# Altium project Flight_Control_Board_Davut_Beyazkaya.PrjPcb
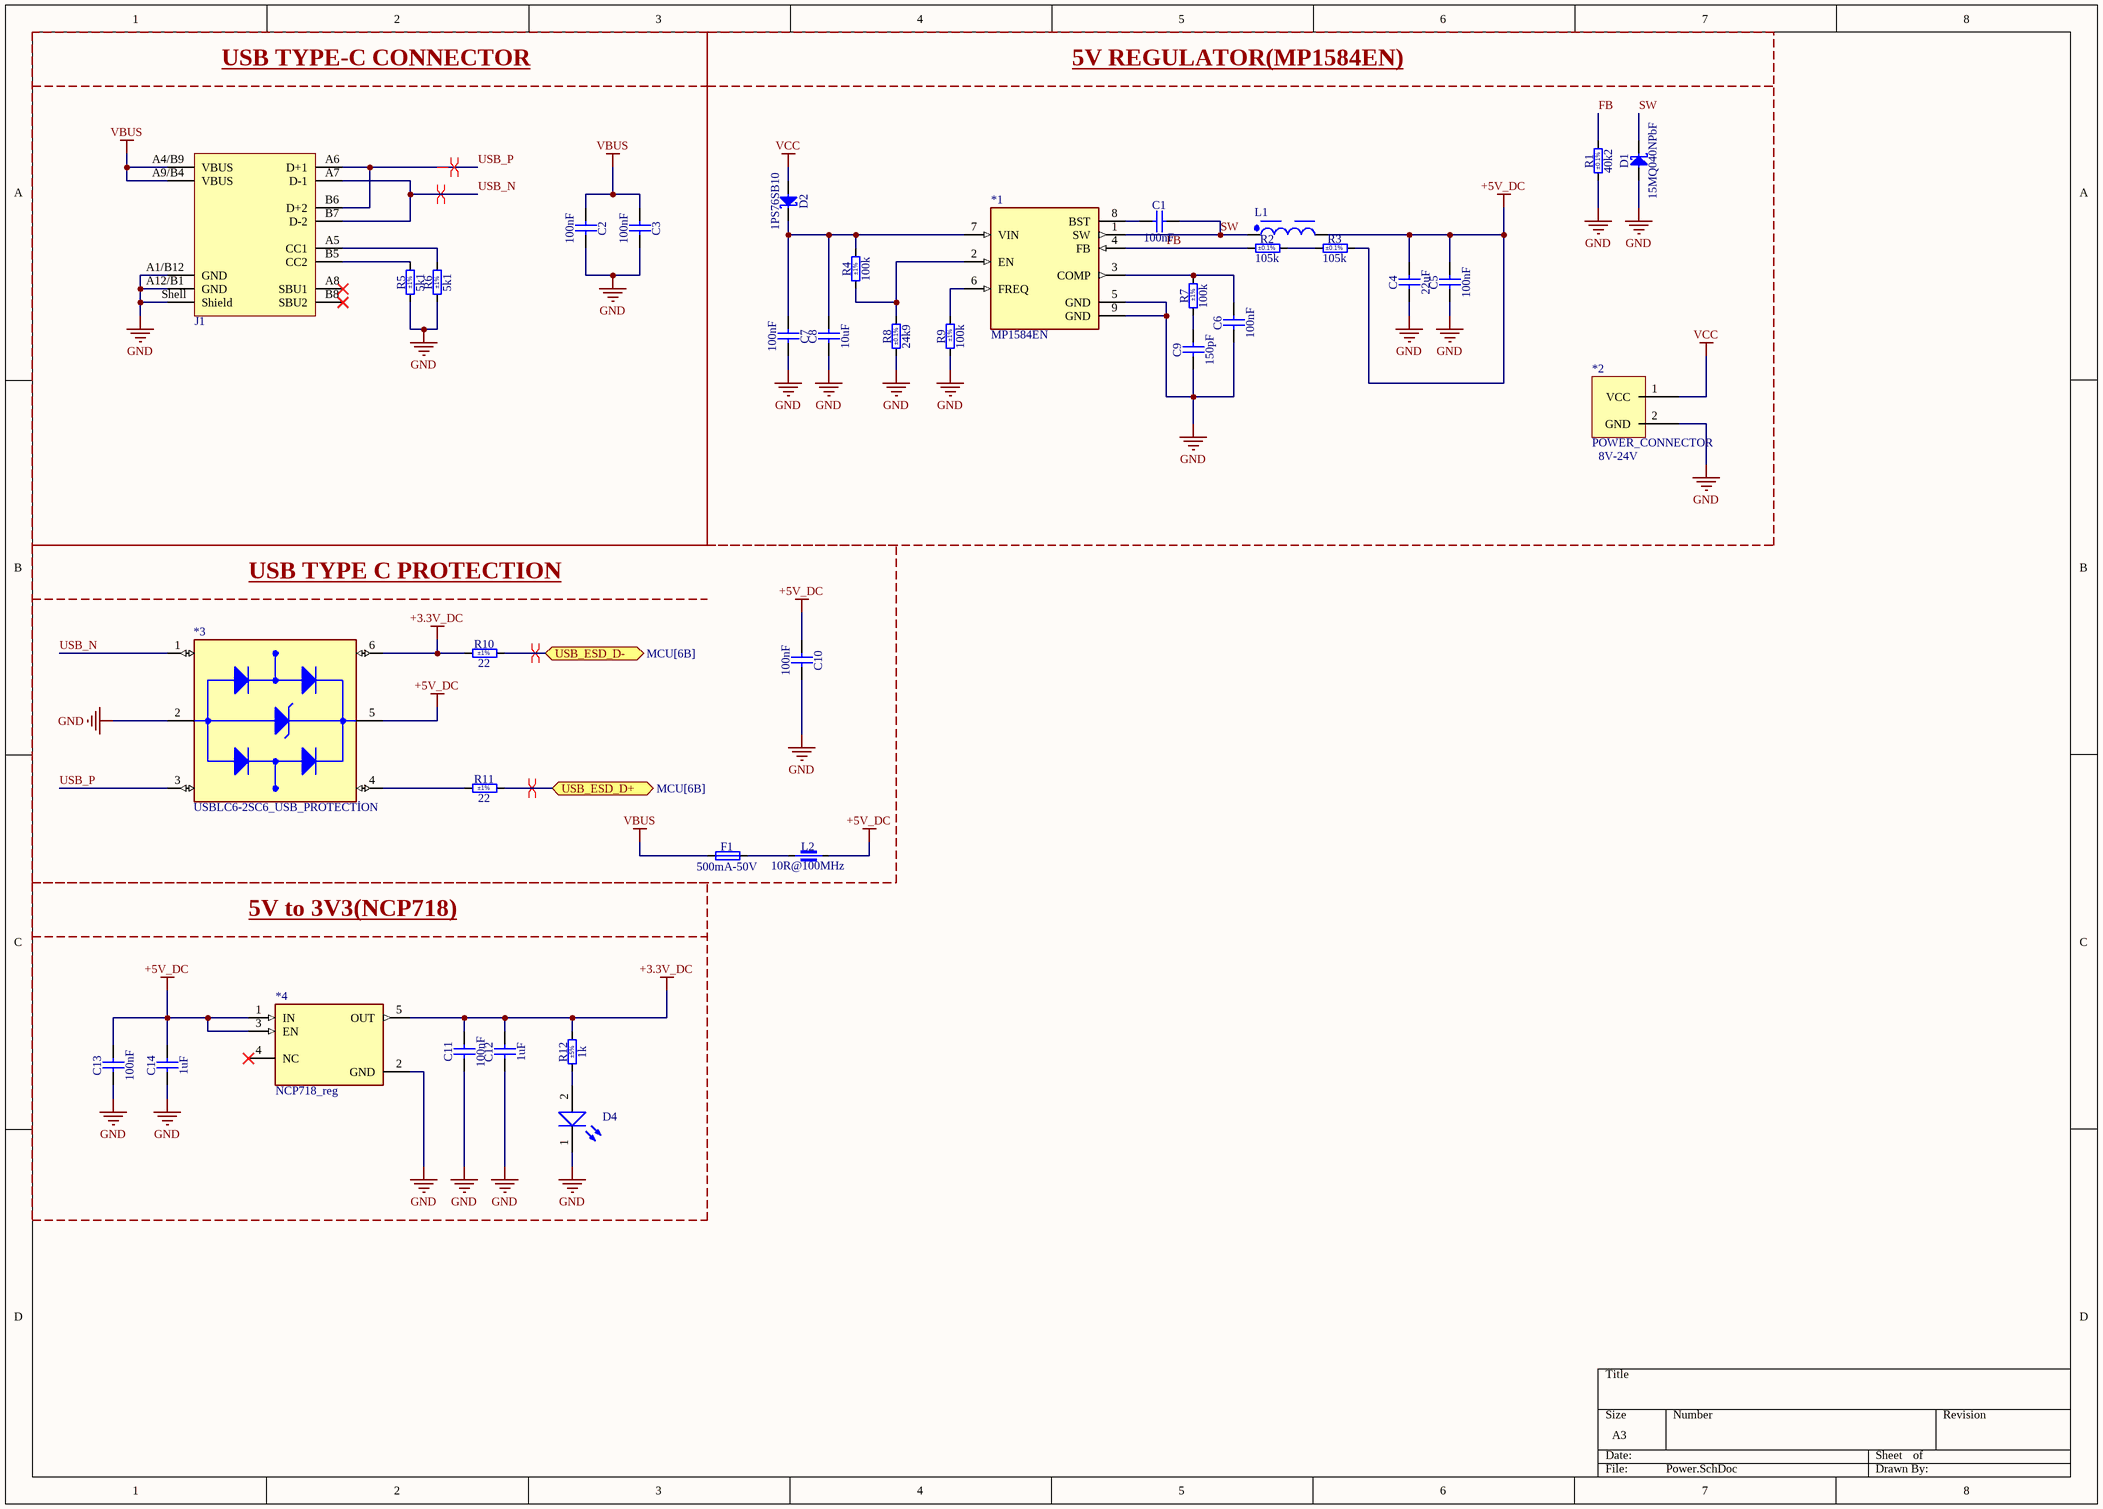
[diagram p0: Power.SchDoc]
3 sheets, 107 parts. Net scope: flat (ports and power ports of the same name join across sheets).
Board file: fligt_control_card.PcbDoc
Sheets:
  Power.SchDoc
  MCU.SchDoc
  Modules.SchDoc

## Sheet Power.SchDoc
size A3; DrawnBy: Davut Beyazkaya; SheetNumber: 1; SheetTotal: 3; SPICEModelCacheTCAMPDML: <root> / <DocumentId>TCAMPDML</DocumentId> / <CacheFrame Number="0"> / <Model Name="3014_158301227" Kind="CKT"> / <Text>************************************************** / * Manufacturer:           Wurth Elektronik / * Kinds:                  SMT White Top view PLCC / * Matchcode:              WL-SWTP / * Library Type:           LTspice / * Version:                rev22a / * Created/modified by:    Ella / * Date and Time:          2022-03-02 / * Team:                   eiSos EDA Service / * Contact:                libraries@we-online.com / ************************************************** / * Copyright(C) 2022 WÃ¼rth Elektronik eiSos GmbH &amp; Co. KG / * All Rights Reserved. / ************************************************** / * Disclaimer: While WÃ¼rth Elektronik eiSos has made every reasonable effort to ensure the accuracy / * of the simulation models provided, WÃ¼rth Elektronik eiSos does not guarantee the exemption of error on / * the simulation models, nor does WÃ¼rth Elektronik eiSos guarantee that the simulation model is current. / * WÃ¼rth Elektronik eiSos reserves the right to make any adjustments at any time without notice. / * WÃ¼rth Elektronik eiSos expressly disclaims all implied warranties regarding this simulation model. / ************************************************** / .subckt 3014_158301227  1  2 / D1 1 2 led / .MODEL led D / + IS=91.819E-12 / + N=4.0378 / + RS=11.199E-6 / + IKF=1.1025E-6 / + CJO=1.0000E-12 / + M=.3333 / + VJ=.75 / + BV=5 / + IBV=5.00E-6 / + TT=5.0000E-9 / .ends</Text> / </Model> / <Model Name="1260_744771115_15u" Kind="CKT"> / <Text>******* / .subckt 1260_744771115_15u 1 2 / Rp 1 2 13381 / Cp 1 2 6.382p / Rs 1 N3 0.022 / L1 N3 2 12.996u / .ends 1260_744771115_15u</Text> / </Model> / </CacheFrame> / </root>

### Parts
*1  MP1584EN  [MP1584EN]
*2  POWER_CONNECTOR  [POWER_CONNECTOR_lion_batt]
*3  USBLC6-2SC6_USB_PROTECTİON  [USBLC6-2SC6_USB_PROTECTION]
*4  NCP718_reg  [NCP718_reg]
C1  100nF  [CAPC2012X135N]
C2  100nF  [CAPC2012X135N]
C3  100nF  [CAPC2012X135N]
C4  22uF  [CAPC2012X135N]
C5  100nF  [CAPC2012X135N]
C6  100nF  [CAPC2012X135N]
C7  100nF  [CAPC2012X135N]
C8  10uF  [CAPC2012X145N]
C9  150pF  [CAPC2012X135N]
C10  100nF  [CAPC2012X135N]
C11  100nF  [CAPC2012X135N]
C12  1uF  [CAPC2012X140N]
C13  100nF  [CAPC2012X135N]
C14  1uF  [CAPC2012X140N]
D1  15MQ040NPbF  [DIOM5027X244N]
D2  1PS76SB10  [SOD2512X110N]
D4  Sunrise, 3V, 120°  [WL-SWTP_3014_L3W1.4H0.8]  (value not drawn)
F1  500mA-50V  [FUSC_BOURNS_SF-0603F]
J1  629722000214  [629722000214]  (value not drawn)
L1  15uH, 4.2A  [WE-PD_1260]  (value not drawn)
L2  10R@100MHz  [INDC1608X95N]
R1  40k2  Tolerance: ±0.1%  [RESC2012X60N]
R2  105k  Tolerance: ±0.1%  [RESC2012X60N]
R3  105k  Tolerance: ±0.1%  [RESC2012X60N]
R4  100k  Tolerance: ±1%  [RESC2012X60N]
R5  5k1  Tolerance: ±1%  [RESC2012X60N]
R6  5k1  Tolerance: ±1%  [RESC2012X60N]
R7  100k  Tolerance: ±1%  [RESC2012X60N]
R8  24k9  Tolerance: ±0.1%  [RESC2012X60N]
R9  100k  Tolerance: ±1%  [RESC2012X60N]
R10  22  Tolerance: ±1%  [RESC2012X60N]
R11  22  Tolerance: ±1%  [RESC2012X60N]
R12  1k  Tolerance: ±5%  [RESC2012X60N]

### Blocks framed on the sheet
USB TYPE-C CONNECTOR: C2 C3 J1 R5 R6
5V REGULATOR(MP1584EN): *1 *2 C1 C4-C9 D1 D2 L1 R1-R4 R7-R9
USB TYPE C PROTECTION: *3 C10 F1 L2 R10 R11
5V to 3V3(NCP718): *4 C11-C14 D4 R12

### Ports
USB_ESD_D+ (bidir, see MCU[6B]), USB_ESD_D- (bidir, see MCU[6B])

### Nets
+3.3V_DC: *3.6(I/O1_OUT) *4.5(OUT) C11.2 C12.2 R10.1 R12.2
+5V_DC: *3.5(VBUS) *4.1(IN) *4.3(EN) C4.2 C5.2 C10.1 C13.2 C14.2 L1.2 L2.2 R3.2
GND: *1.5(GND) *1.9(GND) *2.2(GND) *3.2(GND) *4.2(GND) C2.2 C3.2 C4.1 C5.1 C6.1 C7.2 C8.1 C9.1 C10.2 C11.1 C12.1 C13.1 C14.1 D1.2(A) D4.1(K) J1.A1/B12(GND) J1.A12/B1(GND) J1.Shell(Shield) R1.1 R5.1 R6.1 R8.1 R9.1
VBUS: C2.1 C3.1 F1.1 J1.A4/B9(VBUS) J1.A9/B4(VBUS)
VCC: *2.1(VCC) D2.2(A)
FB: *1.4(FB) R1.2 R2.1
SW: *1.1(SW) C1.2 D1.1(C) L1.1
USB_N: *3.1(I/O1_IN) J1.A7(D-1) J1.B7(D-2)
USB_P: *3.3(I/O2_IN) J1.A6(D+1) J1.B6(D+2)
Net*1_2: *1.2(EN) R4.1 R8.2
Net*1_3: *1.3(COMP) C6.2 R7.2
Net*1_6: *1.6(FREQ) R9.2
Net*1_7: *1.7(VIN) C7.1 C8.2 D2.1(C) R4.2
Net*1_8: *1.8(BST) C1.1
Net*3_4: *3.4(I/O2_OUT) R11.1
NetC9_2: C9.2 R7.1
NetD4_2: D4.2(A) R12.1
NetF1_2: F1.2 L2.1
NetIC1_44: R10.2 ; port USB_ESD_D-
NetIC1_45: R11.2 ; port USB_ESD_D+
NetJ1_A5: J1.A5(CC1) R6.2
NetJ1_B5: J1.B5(CC2) R5.2
NetR2_2: R2.2 R3.1

Not connected (* = marked no-connect by the designer): *4 4(NC)*; J1 A8(SBU1)* B8(SBU2)*

### Layout directives
differential pair: NetIC1_44, NetIC1_45, USB_N, USB_P

### Notes on the sheet
- (near *2) 8V-24V

### Library data of the parts
*2 = POWER_CONNECTOR_lion_batt
C1-C3 C5-C7 C10 C11 C13 = CC0805_100NF_50V_10%_X7R: Non-polarised capacitor; Part Description: SMD Multilayer Chip Ceramic Capacitor; Manufacturer: GENERIC; Manufacturer1 Part Number: C2012X7R1H104K085; Voltage: 50V; TC: X7R; Tolerance: ±10%; Part Number: CC0805_100NF_50V_10%_X7R; Component Kind: Standard; Component Type: Standard; Pin Count: 2; Value: 100nF; Status: None; Manufacturer Part Number: CC0805_100NF_50V_10%_X7R; Case: 0805; Mounted: Yes; Socket: No; SMD: Yes; Sense: No; Manufacturer1 Example: TDK; Manufacturer1 ComponentHeight: 1mm; HelpURL: \\cern.ch\dfs\Applications\Altium\Datasheets\CC0805_X7R_TDK_C.pdf; Author: CERN DEM JLC; CreateDate: 3.12.2007; LatestRevisionDate: 22.04.2015
C4 = CC0805_22UF_16V_10%_X5R: Non-polarised capacitor; Part Description: SMD Multilayer Chip Ceramic Capacitor; Manufacturer: GENERIC; Manufacturer1 Part Number: C2012X5R1C226KT; Voltage: 16V; TC: X5R; Tolerance: ±10%; Part Number: CC0805_22UF_16V_10%_X5R; Component Kind: Standard; Component Type: Standard; Pin Count: 2; Value: 22uF; Status: Preferred; Manufacturer Part Number: CC0805_22UF_16V_10%_X5R; Case: 0805; Mounted: Yes; Socket: No; SMD: Yes; Sense: No; Manufacturer1 Example: TDK; Manufacturer1 ComponentHeight: 1.35mm; HelpURL: \\cern.ch\dfs\Applications\Altium\Datasheets\CC0805_X5R_TDK_C.pdf; Author: CERN DEM JLC; CreateDate: 25.10.2012; LatestRevisionDate: 25.10.2012
C8 = CC0805_10UF_25V_10%_X5R_YUDEN_TMK212BBJ106KGHT: Non-polarised capacitor; Part Description: SMD Multilayer Chip Ceramic Capacitor (High Dielectric Type) for Automotive / Industrial Applications; Manufacturer: TAIYO YUDEN; Voltage: 25V; TC: X5R; Tolerance: ±10%; Part Number: CC0805_10UF_25V_10%_X5R_YUDEN_TMK212BBJ106KGHT; Component Kind: Standard; Component Type: Standard; Pin Count: 2; Value: 10uF; Status: Not Recommended; Manufacturer Part Number: TMK212BBJ106KGHT; Case: 0805; Mounted: Yes; Socket: No; SMD: Yes; Sense: No; ComponentHeight: 1.45mm; HelpURL: \\cern.ch\dfs\Applications\Altium\Datasheets\CC0805_TAIYO-YUDEN_TMK212BBJ106KGHT.pdf; Author: CERN DEM JLC; CreateDate: 23.01.2018; LatestRevisionDate: 23.01.2018
C9 = CC0805_150PF_50V_5%_C0G: Non-polarised capacitor; Part Description: SMD Multilayer Chip Ceramic Capacitor; Manufacturer: GENERIC; Manufacturer1 Part Number: C0805C151J5GACTU; Voltage: 50V; TC: C0G/NP0; Tolerance: ±5%; Part Number: CC0805_150PF_50V_5%_C0G; Component Kind: Standard; Component Type: Standard; Pin Count: 2; Value: 150pF; Status: Preferred; Manufacturer Part Number: CC0805_150PF_50V_5%_C0G; Case: 0805; Mounted: Yes; Socket: No; SMD: Yes; Sense: No; Manufacturer1 Example: KEMET; Manufacturer1 ComponentHeight: 0.88mm; HelpURL: \\cern.ch\dfs\Applications\Altium\Datasheets\CC0805_C0G_KEMET_(Commercial Grade).pdf; Author: CERN DEM JLC; CreateDate: 3.12.2007; LatestRevisionDate: 22.04.2015
C12 C14 = CC0805_1UF_35V_20%_X7R: Non-polarised capacitor; Part Description: SMD Multilayer Chip Ceramic Capacitor; Manufacturer: GENERIC; Manufacturer1 Part Number: GMK212B7105MG-T; Voltage: 35V; TC: X7R; Tolerance: ±20%; Part Number: CC0805_1UF_35V_20%_X7R; Component Kind: Standard; Component Type: Standard; Pin Count: 2; Value: 1uF; Status: Not Recommended; Manufacturer Part Number: CC0805_1UF_35V_20%_X7R; Case: 0805; Mounted: Yes; Socket: No; SMD: Yes; Sense: No; Manufacturer1 Example: TAIYO YUDEN; Manufacturer1 ComponentHeight: 1.35mm; HelpURL: \\cern.ch\dfs\Applications\Altium\Datasheets\CC0805_X7R_TAIYO-YUDEN_HIGH-VALUE.pdf; Author: CERN DEM JLC; CreateDate: 22.06.2011; LatestRevisionDate: 22.06.2011
D1 = 15MQ040NPbF: Schottky Diode; Part Description: Schottky Rectifier; Manufacturer: VISHAY INTERTECHNOLOGY, INC.; Voltage: 40V; Power: 3A; PressFit: No; Bonding: No; Part Number: 15MQ040NPbF; Component Kind: Standard; Component Type: Standard; Device: 15MQ040NPbF; PackageDescription: DO-214-AC/SMA  Molded Diode, Body 5.0x2.7mm, IPC Medium Density; Status: Obsolete; Manufacturer Part Number: 15MQ040N; Pin Count: 2; Case: DO-214AC; Mounted: Yes; Socket: No; SMD: Yes; Sense: No; ComponentHeight: 2.44mm; HelpURL: \\cern.ch\dfs\Applications\Altium\Datasheets\15MQ040NPbF.pdf; Author: CERN DEM JLC; CreateDate: 9.03.2009; LatestRevisionDate: 9.06.2022
D2 = 1PS76SB10: Schottky Diode; Part Description: Schottky Barrier Single Diode; Manufacturer: NXP SEMICONDUCTORS; Voltage: 30V; Power: 200mA; PressFit: No; Bonding: No; Part Number: 1PS76SB10; Component Kind: Standard; Component Type: Standard; Device: 1PS76SB10; PackageDescription: Small Outline Diode (SOD-323), 1.70mm W X 1.25mm L X 1.10mm H body,  IPC Medium Density; Manufacturer Part Number: 1PS76SB10; Pin Count: 2; Case: SOD-323; Mounted: Yes; Socket: No; SMD: Yes; Sense: No; ComponentHeight: 1.1mm; HelpURL: \\cern.ch\dfs\Applications\Altium\Datasheets\1PS76SB10.pdf; Author: CERN DEM JLC; CreateDate: 6.12.2012; LatestRevisionDate: 6.12.2012
D4 = 158301227: WL-SWTP SMT White Top view PLCC, size 3014, Sunrise, 3V, 120°; Manufacturer: Wurth Elektronik; Case/Size Code: 3014; Chip Technology: InGaN; Color Rendering Index: 85; Correlated Color Temperature: 2700K; Luminous Flux: 8lm; Manufacturer Part Number: 158301227; Category: General Lighting; Match Code: WL-SWTP; ComponentLink1Description: Website Link; ComponentLink1URL: https://www.we-online.com/redexpert/article/158301227?ad; ComponentLink2Description: Datasheet Link; ComponentLink2URL: https://www.we-online.com/redexpert/spec/158301227?ad; Mount: Surface Mount; Operating Temperature Max: 85°C; Operating Temperature Min: -40°C; Packaging: Tape and Reel; Length: 3mm; Width: 1.4mm; Height: 0.8mm; Emitting Color: Sunrise; Forward Voltage: 3V; Viewing Angle: 120°
F1 = FUS0603_BOURNS-SF-0603F050-2: Fuse; Part Description: Fast Acting Thin Film Chip Fuse for Overcurrent Protection, SinglFuse™ SF-0603F  Series; Manufacturer: BOURNS; PressFit: No; Part Number: FUS0603_BOURNS-SF-0603F050-2; Component Kind: Standard; Component Type: Standard; Pin Count: 2; Case: 0603; PackageDescription: Chip Fuse, 2-Leads, Body 1.6mm x 0.8mm, IPC Medium Density; Family: Fuse; Mounted: Yes; Socket: No; SMD: Yes; Sense: No; Value: 500mA-50V; Manufacturer Part Number: SF-0603F050-2; ComponentHeight: 0.55mm; HelpURL: \\cern.ch\dfs\Applications\Altium\Datasheets\FUSC_BOURNS_SF-0603F.pdf; Author: CERN DEM JLC; CreateDate: 1.02.2017; LatestRevisionDate: 1.02.2017
J1 = 629722000214: WR-COM USB 2.0 Type C Receptacle Horizontal SMT; Manufacturer: Wurth Elektronik; Match Code: WR-USB; Interface Type: Type C; Number of Ports: 1; Rated Current: 5A; Working Voltage: 20V (DC); Manufacturer Part Number: 629722000214; Category: Input/Output Connectors; ComponentLink1Description: Website Link; ComponentLink1URL: https://www.we-online.com/redexpert/article/629722000214?ad; ComponentLink2Description: Datasheet Link; ComponentLink2URL: https://www.we-online.com/redexpert/spec/629722000214?ad; Mount: Surface Mount; Operating Temperature Max: 85°C; Operating Temperature Min: -40°C; Packaging: Tape and Reel; Application: USB 2.0; Gender: Receptacle; Number of Pins: 16; Orientation: Horizontal
L1 = 744771115: WE-PD SMT Power Inductor, size 1260, 15uH, 4.2A, 28mOhm; Manufacturer: Wurth Elektronik; Case/Size Code: 1260; DC Resistance: 22mOhm; Saturation Current: 4.5A; Self Resonant Frequency: 16.6MHz; Type: Standard; Manufacturer Part Number: 744771115; Category: Power Inductors; Match Code: WE-PD; ComponentLink1Description: Website Link; ComponentLink1URL: https://www.we-online.com/redexpert/article/744771115?ad; ComponentLink2Description: Datasheet Link; ComponentLink2URL: https://www.we-online.com/redexpert/spec/744771115?ad; Mount: Surface Mount; Operating Temperature Max: 125°C; Operating Temperature Min: -40°C; Packaging: Tape and Reel; Length: 12mm; Width: 12mm; Height: 6mm; DC Resistance Max: 28mOhm; Inductance: 15uH; Rated Current: 4.2A
L2 = IND0603_MURATA_BLM18BA100SN1D: Part Description: SMD EMIFIL Suppression Chip Ferrite Bead; Manufacturer: MURATA; Power: 500mA; Resistance: 0.25R; Tolerance: ±25%; Part Number: IND0603_MURATA_BLM18BA100SN1D; Component Kind: Standard; Component Type: Standard; Pin Count: 2; Value: 10R@100MHz; Manufacturer Part Number: BLM18BA100SN1D; Case: 0603; Mounted: Yes; Socket: No; SMD: Yes; Sense: No; ComponentHeight: 0.95mm; HelpURL: \\cern.ch\dfs\Applications\Altium\Datasheets\IND0603_MURATA_BLM18B.pdf; Author: CERN DEM JLC; CreateDate: 13.01.2014; LatestRevisionDate: 25.10.2018
R1 = R0805_40K2_0.1%_0.125W_15PPM: Resistor - 0.1%; Part Description: Thin Film Chip Resistor; Manufacturer: GENERIC; Manufacturer1 Part Number: RP73D2A40K2BTG; Power: 0.125W; TC: ±15ppm/°C; PressFit: No; Part Number: R0805_40K2_0.1%_0.125W_15PPM; Component Kind: Standard; Component Type: Standard; Pin Count: 2; Value: 40k2; Status: Not Recommended; Manufacturer Part Number: R0805_40K2_0.1%_0.125W_15PPM; Case: 0805; Mounted: Yes; Sense: No; Socket: No; SMD: Yes; Manufacturer1 Example: TYCO ELECTRONICS; Manufacturer1 ComponentHeight: 0.65mm; HelpURL: \\cern.ch\dfs\Applications\Altium\Datasheets\R0805_TYCO_RP73.pdf; Author: CERN DEM JLC; CreateDate: 5.03.2015; LatestRevisionDate: 28.06.2022
R2 R3 = R0805_105K_0.1%_0.1W_10PPM: Resistor - 0.1%; Part Description: Thin Film Chip Resistor; Manufacturer: GENERIC; Manufacturer1 Part Number: RN73C2A105KBTG; Power: 0.1W; TC: ±10ppm; PressFit: No; Part Number: R0805_105K_0.1%_0.1W_10PPM; Component Kind: Standard; Component Type: Standard; Pin Count: 2; Value: 105k; Status: Not Recommended; Manufacturer Part Number: R0805_105K_0.1%_0.1W_10PPM; Case: 0805; Mounted: Yes; Sense: No; Socket: No; SMD: Yes; Manufacturer1 Example: TYCO HOLSWORTHY; Manufacturer1 ComponentHeight: 0.6mm; HelpURL: \\cern.ch\dfs\Applications\Altium\Datasheets\R0805_Tyco_RN73.pdf; Author: CERN DEM JLC; CreateDate: 3.12.2007; LatestRevisionDate: 13.03.2008
R4 R7 R9 = R0805_100K_1%_0.125W_100PPM: Resistor - 1%; Part Description: General Purpose Thick Film Chip Resistor; Manufacturer: GENERIC; Manufacturer1 Part Number: NRC10F1003TRF; Power: 0.125W; TC: ±100ppm/°C; PressFit: No; Part Number: R0805_100K_1%_0.125W_100PPM; Component Kind: Standard; Component Type: Standard; Pin Count: 2; Value: 100k; Status: Preferred; Manufacturer Part Number: R0805_100K_1%_0.125W_100PPM; Case: 0805; Mounted: Yes; Sense: No; Socket: No; SMD: Yes; Manufacturer1 Example: NIC COMPONENT; Manufacturer1 ComponentHeight: 0.6mm; HelpURL: \\cern.ch\dfs\Applications\Altium\Datasheets\R0805_NIC_NRC.pdf; Author: CERN DEM JLC; CreateDate: 3.12.2007; LatestRevisionDate: 13.03.2008
R5 R6 = R0805_5K1_1%_0.125W_100PPM: Resistor - 1%; Part Description: General Purpose Thick Film Chip Resistor; Manufacturer: GENERIC; Manufacturer1 Part Number: NRC10F5101TRF; Power: 0.125W; TC: ±100ppm/°C; PressFit: No; Part Number: R0805_5K1_1%_0.125W_100PPM; Component Kind: Standard; Component Type: Standard; Pin Count: 2; Value: 5k1; Status: Preferred; Manufacturer Part Number: R0805_5K1_1%_0.125W_100PPM; Case: 0805; Mounted: Yes; Sense: No; Socket: No; SMD: Yes; Manufacturer1 Example: NIC COMPONENT; Manufacturer1 ComponentHeight: 0.6mm; HelpURL: \\cern.ch\dfs\Applications\Altium\Datasheets\R0805_NIC_NRC.pdf; Author: CERN DEM JLC; CreateDate: 3.12.2007; LatestRevisionDate: 13.03.2008
R8 = R0805_24K9_0.1%_0.1W_10PPM: Resistor - 0.1%; Part Description: Thin Film Chip Resistor; Manufacturer: GENERIC; Manufacturer1 Part Number: RN73C2A24K9BTG; Power: 0.1W; TC: ±10ppm; PressFit: No; Part Number: R0805_24K9_0.1%_0.1W_10PPM; Component Kind: Standard; Component Type: Standard; Pin Count: 2; Value: 24k9; Status: Not Recommended; Manufacturer Part Number: R0805_24K9_0.1%_0.1W_10PPM; Case: 0805; Mounted: Yes; Sense: No; Socket: No; SMD: Yes; Manufacturer1 Example: TYCO HOLSWORTHY; Manufacturer1 ComponentHeight: 0.6mm; HelpURL: \\cern.ch\dfs\Applications\Altium\Datasheets\R0805_Tyco_RN73.pdf; Author: CERN DEM JLC; CreateDate: 3.12.2007; LatestRevisionDate: 13.03.2008
R10 R11 = R0805_22R_1%_0.125W_100PPM: Resistor - 1%; Part Description: General Purpose Thick Film Chip Resistor; Manufacturer: GENERIC; Manufacturer1 Part Number: NRC10F22R0TRF; Power: 0.125W; TC: ±100ppm/°C; PressFit: No; Part Number: R0805_22R_1%_0.125W_100PPM; Component Kind: Standard; Component Type: Standard; Pin Count: 2; Value: 22; Status: Preferred; Manufacturer Part Number: R0805_22R_1%_0.125W_100PPM; Case: 0805; Mounted: Yes; Sense: No; Socket: No; SMD: Yes; Manufacturer1 Example: NIC COMPONENT; Manufacturer1 ComponentHeight: 0.6mm; HelpURL: \\cern.ch\dfs\Applications\Altium\Datasheets\R0805_NIC_NRC.pdf; Author: CERN DEM JLC; CreateDate: 3.12.2007; LatestRevisionDate: 13.03.2008
R12 = R0805_1K_0.1%_0.125W_25PPM: Resistor - 0.1%; Part Description: Thin Film Chip Resistor; Manufacturer: GENERIC; Manufacturer1 Part Number: ERA6AEB102V; Power: 0.125W; TC: ±25ppm; PressFit: No; Part Number: R0805_1K_0.1%_0.125W_25PPM; Component Kind: Standard; Component Type: Standard; Pin Count: 2; Value: 1k; Status: Not Recommended; Manufacturer Part Number: R0805_1K_0.1%_0.125W_25PPM; Case: 0805; Mounted: Yes; Sense: No; Socket: No; SMD: Yes; Manufacturer1 Example: PANASONIC; Manufacturer1 ComponentHeight: 0.6mm; HelpURL: \\cern.ch\dfs\Applications\Altium\Datasheets\R0805_PANASONIC_ERA.pdf; Author: CERN DEM JLC; CreateDate: 18.10.2010; LatestRevisionDate: 18.10.2010

## Sheet MCU.SchDoc
size A3; SheetNumber: 2; SheetTotal: 3; SPICEModelCacheELPNFJPW: <root> / <DocumentId>ELPNFJPW</DocumentId> / <CacheFrame Number="0"> / <Model Name="0603_150060rs75003" Kind="CKT"> / <Text>****** / .subckt 0603_150060RS75003  1  2 / D1 1 2 SMCW / .MODEL SMCW D / + IS=1.0025E-15 / + N=2.2259 / + RS=.3926 / + IKF=240.91E-6 / + CJO=1.0000E-12 / + M=.3333 / + VJ=.75 / + BV=5 / + IBV=10.00E-6 / + TT=5.0000E-9 / .ends</Text> / </Model> / <Model Name="0603_150060vs55040" Kind="CKT"> / <Text>***************************** / .subckt 0603_150060VS55040 1 2 / D1 1 2 SMCD / .MODEL SMCD D / + IS=135.21E-15 / + N=2.0992 / + RS=1.0413 / + IKF=173.47E-9 / + CJO=1.0000E-12 / + M=.3333 / + VJ=.75 / + BV=5 / + IBV=100.00E-6 / + TT=5.0000E-9 / .ends</Text> / </Model> / <Model Name="0603_150060ys55040" Kind="CKT"> / <Text>***************************** / .subckt 0603_150060YS55040 1 2 / D1 1 2 SMCD / .MODEL SMCD D / + IS=135.21E-15 / + N=2.0992 / + RS=1.0413 / + IKF=173.47E-9 / + CJO=1.0000E-12 / + M=.3333 / + VJ=.75 / + BV=5 / + IBV=100.00E-6 / + TT=5.0000E-9 / .ends</Text> / </Model> / <Model Name="0603_150060bs75020" Kind="CKT"> / <Text>****** / .subckt 0603_150060BS75020  1  2 / D1 1 2 SMCW / .MODEL SMCW D / + IS=7.6676E-9 / + N=5 / + RS=2.6261 / + IKF=1.3194E-6 / + CJO=1.0000E-12 / + M=.3333 / + VJ=.75 / + BV=5 / + IBV=10.00E-6 / + TT=5.0000E-9 / .ends</Text> / </Model> / </CacheFrame> / </root>
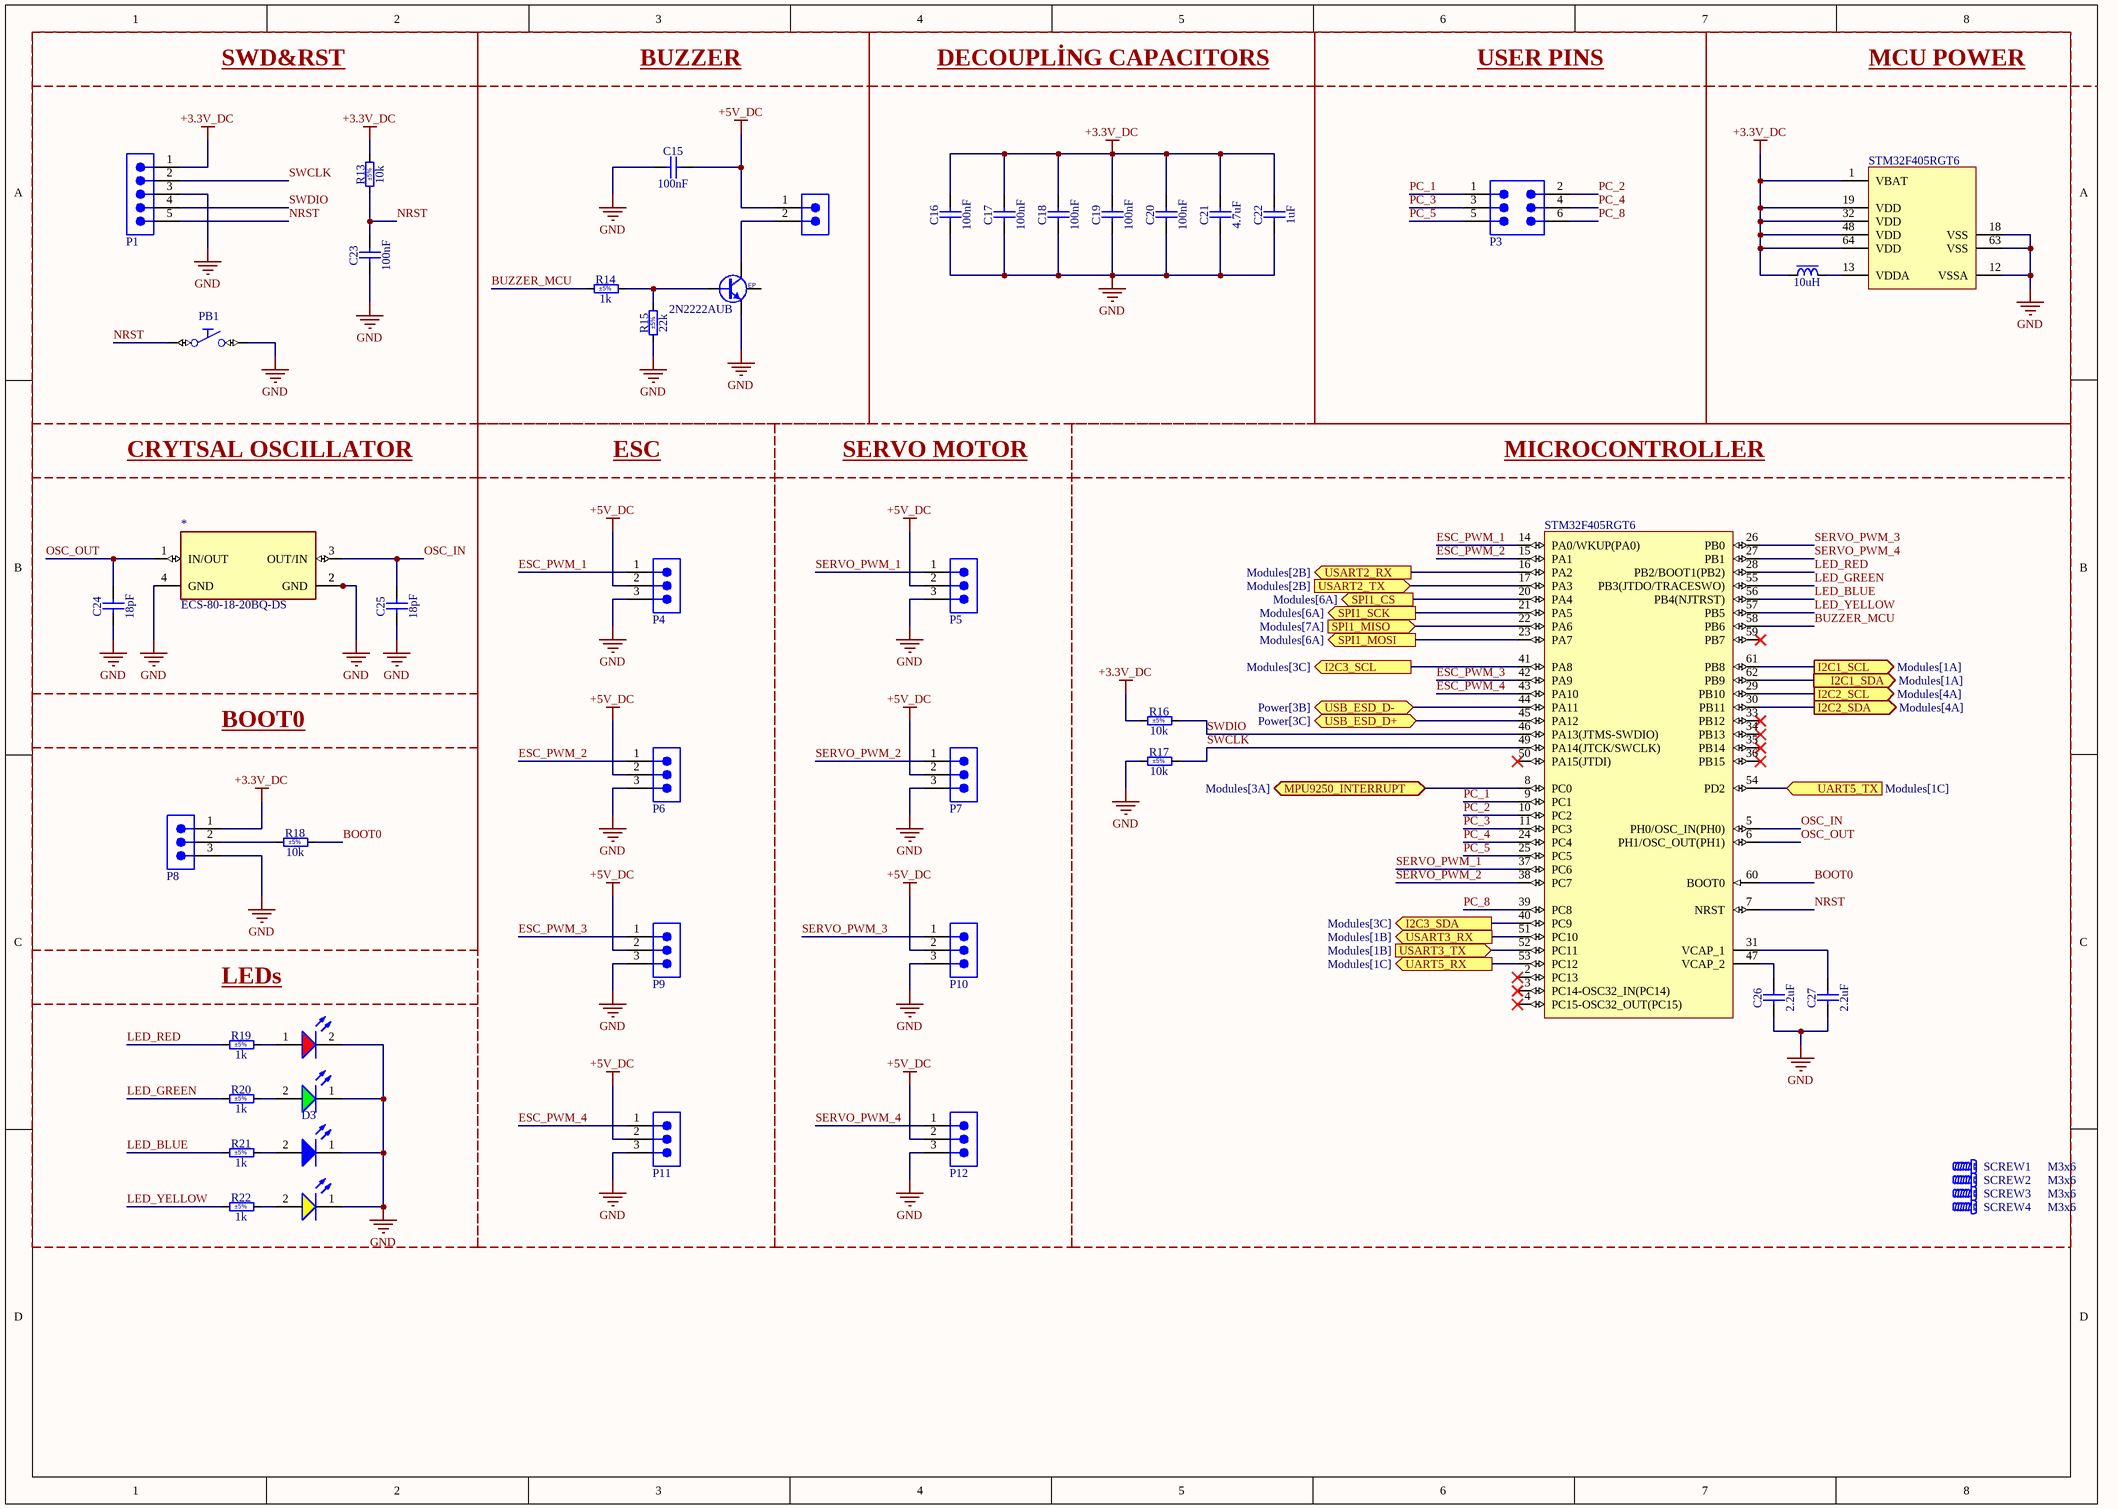
[diagram p1: MCU.SchDoc]

### Parts
*  ECS-80-18-20BQ-DS  [ECS-80-18-20BQ-DS]
C15  100nF  [CAPC2012X135N]
C16  100nF  [CAPC2012X135N]
C17  100nF  [CAPC2012X135N]
C18  100nF  [CAPC2012X135N]
C19  100nF  [CAPC2012X135N]
C20  100nF  [CAPC2012X135N]
C21  4.7uF  [CAPC2012X135N]
C22  1uF  [CAPC2012X145N]
C23  100nF  [CAPC2012X135N]
C24  18pF  [CAPC2012X135N]
C25  18pF  [CAPC2012X135N]
C26  2.2uF  [CAPC2012X135N]
C27  2.2uF  [CAPC2012X135N]
D3  Blue, 3.2V, 140°  [WL-SMCW_0603_150060xx75020]  (value not drawn)
D5  Red, 2V, 140°  [WL-SMCW_0603_150060xx75003]  (value not drawn)
D6  Bright Green, 2V, 140°  [WL-SMCD_0603]  (value not drawn)
D8  Yellow, 2V, 140°  [WL-SMCD_0603]  (value not drawn)
IC1  STM32F405RGT6  [QFP50P1200X1200X160-64N]  (parts A,B of 2)
L3  10uH  [IND_MURATA-PS_8200]
P1  61300511121  [61300511121]  (value not drawn)
P2  691322310002  [691322310002]  (value not drawn)
P3  61300621121  [61300621121]  (value not drawn)
P4  61300311121  [61300311121]  (value not drawn)
P5  61300311121  [61300311121]  (value not drawn)
P6  61300311121  [61300311121]  (value not drawn)
P7  61300311121  [61300311121]  (value not drawn)
P8  61300311121  [61300311121]  (value not drawn)
P9  61300311121  [61300311121]  (value not drawn)
P10  61300311121  [61300311121]  (value not drawn)
P11  61300311121  [61300311121]  (value not drawn)
P12  61300311121  [61300311121]  (value not drawn)
PB1  Push Button  [PB_C&K_KSR2xxGLF]  (value not drawn)
R13  10k  Tolerance: ±5%  [RESC2012X60N]
R14  1k  Tolerance: ±5%  [RESC2012X60N]
R15  22k  Tolerance: ±5%  [RESC2012X60N]
R16  10k  Tolerance: ±5%  [RESC2012X60N]
R17  10k  Tolerance: ±5%  [RESC2012X60N]
R18  10k  Tolerance: ±5%  [RESC2012X60N]
R19  1k  Tolerance: ±5%  [RESC2012X60N]
R20  1k  Tolerance: ±5%  [RESC2012X60N]
R21  1k  Tolerance: ±5%  [RESC2012X60N]
R22  1k  Tolerance: ±5%  [RESC2012X60N]
SCREW1  M3x6  [BOSSARD_BN5687-3061605_v]
SCREW2  M3x6  [BOSSARD_BN5687-3061605_v]
SCREW3  M3x6  [BOSSARD_BN5687-3061605_v]
SCREW4  M3x6  [BOSSARD_BN5687-3061605_v]
T1  2N2222AUB  [MICROSEMI_UB]

### Blocks framed on the sheet
SWD&RST: C23 P1 PB1 R13
BUZZER: C15 P2 R14 R15 T1
DECOUPLİNG CAPACITORS: C16-C22
USER PINS: P3
MCU POWER: IC1 L3
CRYTSAL OSCILLATOR: * C24 C25
ESC: P4 P6 P9 P11
SERVO MOTOR: P5 P7 P10 P12
MICROCONTROLLER: C26 C27 IC1 R16 R17 SCREW1-SCREW4
BOOT0: P8 R18
LEDs: D3 D5 D6 D8 R19-R22

### Ports
I2C1_SCL (out, see Modules[1A]), I2C1_SDA (out, see Modules[1A]), I2C2_SCL (out, see Modules[4A]), I2C2_SDA (out, see Modules[4A]), I2C3_SCL (out, see Modules[3C]), I2C3_SDA (out, see Modules[3C]), MPU9250_INTERRUPT (bidir, see Modules[3A]), SPI1_CS (out, see Modules[6A]), SPI1_MISO (in, see Modules[7A]), SPI1_MOSI (out, see Modules[6A]), SPI1_SCK (out, see Modules[6A]), UART5_RX (out, see Modules[1C]), UART5_TX (in, see Modules[1C]), USART2_RX (out, see Modules[2B]), USART2_TX (in, see Modules[2B]), USART3_RX (out, see Modules[1B]), USART3_TX (in, see Modules[1B]), USB_ESD_D+ (bidir, see Power[3C]), USB_ESD_D- (bidir, see Power[3B])

### Nets
+3.3V_DC: C16.2 C17.2 C18.2 C19.2 C20.2 C21.2 C22.2 IC1.1(VBAT) IC1.19(VDD) IC1.32(VDD) IC1.48(VDD) IC1.64(VDD) L3.1 P1.1 P8.1 R13.2 R16.1
+5V_DC: C15.2 P2.1 P4.2 P5.2 P6.2 P7.2 P9.2 P10.2 P11.2 P12.2
GND: *.2(GND) *.4(GND) C15.1 C16.1 C17.1 C18.1 C19.1 C20.1 C21.1 C22.1 C23.1 C24.1 C25.1 C26.1 C27.1 D3.1(K) D5.2(K) D6.1(K) D8.1(K) IC1.12(VSSA) IC1.18(VSS) IC1.63(VSS) P1.3 P4.3 P5.3 P6.3 P7.3 P8.3 P9.3 P10.3 P11.3 P12.3 PB1.2(NO) R15.1 R17.1 T1.2(E)
BOOT0: IC1.60(BOOT0) R18.2
BUZZER_MCU: IC1.58(PB6) R14.1
ESC_PWM_1: IC1.14(PA0/WKUP(PA0)) P4.1
ESC_PWM_2: IC1.15(PA1) P6.1
ESC_PWM_3: IC1.42(PA9) P9.1
ESC_PWM_4: IC1.43(PA10) P11.1
LED_BLUE: IC1.56(PB4(NJTRST)) R21.1
LED_GREEN: IC1.55(PB3(JTDO/TRACESWO)) R20.1
LED_RED: IC1.28(PB2/BOOT1(PB2)) R19.1
LED_YELLOW: IC1.57(PB5) R22.1
NRST: C23.2 IC1.7(NRST) P1.5 PB1.1(C) R13.1
OSC_IN: *.3(OUT/IN) C25.2 IC1.5(PH0/OSC_IN(PH0))
OSC_OUT: *.1(IN/OUT) C24.2 IC1.6(PH1/OSC_OUT(PH1))
PC_1: IC1.9(PC1) P3.1
PC_2: IC1.10(PC2) P3.2
PC_3: IC1.11(PC3) P3.3
PC_4: IC1.24(PC4) P3.4
PC_5: IC1.25(PC5) P3.5
PC_8: IC1.39(PC8) P3.6
SERVO_PWM_1: IC1.37(PC6) P5.1
SERVO_PWM_2: IC1.38(PC7) P7.1
SERVO_PWM_3: IC1.26(PB0) P10.1
SERVO_PWM_4: IC1.27(PB1) P12.1
SWCLK: IC1.49(PA14(JTCK/SWCLK)) P1.2 R17.2
SWDIO: IC1.46(PA13(JTMS-SWDIO)) P1.4 R16.2
Net*5_1: IC1.20(PA4) ; port SPI1_CS
Net*5_2: IC1.22(PA6) ; port SPI1_MISO
Net*5_5: IC1.23(PA7) ; port SPI1_MOSI
Net*5_6: IC1.21(PA5) ; port SPI1_SCK
NetC26_2: C26.2 IC1.47(VCAP_2)
NetC27_2: C27.2 IC1.31(VCAP_1)
NetD3_2: D3.2(A) R21.2
NetD5_1: D5.1(A) R19.2
NetD6_2: D6.2(A) R20.2
NetD8_2: D8.2(A) R22.2
NetIC1_8: IC1.8(PC0) ; port MPU9250_INTERRUPT
NetIC1_13: IC1.13(VDDA) L3.2
NetIC1_16: IC1.16(PA2) ; port USART2_RX
NetIC1_17: IC1.17(PA3) ; port USART2_TX
NetIC1_29: IC1.29(PB10) ; port I2C2_SCL
NetIC1_30: IC1.30(PB11) ; port I2C2_SDA
NetIC1_40: IC1.40(PC9) ; port I2C3_SDA
NetIC1_41: IC1.41(PA8) ; port I2C3_SCL
NetIC1_44: IC1.44(PA11) ; port USB_ESD_D-
NetIC1_45: IC1.45(PA12) ; port USB_ESD_D+
NetIC1_51: IC1.51(PC10) ; port USART3_RX
NetIC1_52: IC1.52(PC11) ; port USART3_TX
NetIC1_53: IC1.53(PC12) ; port UART5_RX
NetIC1_54: IC1.54(PD2) ; port UART5_TX
NetIC1_61: IC1.61(PB8) ; port I2C1_SCL
NetIC1_62: IC1.62(PB9) ; port I2C1_SDA
NetP2_2: P2.2 T1.3(C)
NetP8_2: P8.2 R18.1
NetR14_2: R14.2 R15.2 T1.1(B)

Not connected (* = marked no-connect by the designer): IC1 2(PC13)* 3(PC14-OSC32_IN(PC14))* 4(PC15-OSC32_OUT(PC15))* 33(PB12)* 34(PB13)* 35(PB14)* 36(PB15)* 50(PA15(JTDI))* 59(PB7)*; T1 4(EP)

### Library data of the parts
C15-C20 C23 = CC0805_100NF_50V_10%_X7R: as C1 on sheet Power; Part Number: CC0805_100NF_50V_10%_X7R; Component Kind: Standard; Component Type: Standard; Pin Count: 2; Value: 100nF; Status: None; Manufacturer Part Number: CC0805_100NF_50V_10%_X7R; Case: 0805; Mounted: Yes; Socket: No; SMD: Yes; Sense: No; Manufacturer1 Example: TDK; Manufacturer1 ComponentHeight: 1mm; HelpURL: \\cern.ch\dfs\Applications\Altium\Datasheets\CC0805_X7R_TDK_C.pdf; Author: CERN DEM JLC; CreateDate: 3.12.2007; LatestRevisionDate: 22.04.2015
C21 = CC0805_4.7UF_10V_10%_X5R: Non-polarised capacitor; Part Description: SMD Multilayer Chip Ceramic Capacitor; Manufacturer: GENERIC; Manufacturer1 Part Number: 222224013672; Voltage: 10V; TC: X5R; Tolerance: ±10%; Part Number: CC0805_4.7UF_10V_10%_X5R; Component Kind: Standard; Component Type: Standard; Pin Count: 2; Value: 4.7uF; Status: Preferred; Manufacturer Part Number: CC0805_4.7UF_10V_10%_X5R; Case: 0805; Mounted: Yes; Socket: No; SMD: Yes; Sense: No; Manufacturer1 Example: PHYCOMP; Manufacturer1 ComponentHeight: 1.45mm; HelpURL: \\cern.ch\dfs\Applications\Altium\Datasheets\CC0805_X5R_PHYCOMP_HC.pdf; Author: CERN DEM JLC; CreateDate: 3.12.2007; LatestRevisionDate: 3.12.2007
C22 = CC0805_1UF_100V_10%_X7S_YUDEN_HMK212BC7105KGHTE: Non-polarised capacitor; Part Description: SMD Multilayer Chip Ceramic Capacitor for Automotive / Industrial Applications; Manufacturer: TAIYO YUDEN; Voltage: 100V; TC: X7S; Tolerance: ±10%; Part Number: CC0805_1UF_100V_10%_X7S_YUDEN_HMK212BC7105KGHTE; Component Kind: Standard; Component Type: Standard; Pin Count: 2; Value: 1uF; Status: Not Recommended; Manufacturer Part Number: HMK212BC7105KGHTE; Case: 0805; Mounted: Yes; Socket: No; SMD: Yes; Sense: No; ComponentHeight: 1.45mm; HelpURL: \\cern.ch\dfs\Applications\Altium\Datasheets\CC0805_TAIYO-YUDEN_HMK212BC7105KGHTE.pdf; Author: CERN DEM JLC; CreateDate: 9.05.2017; LatestRevisionDate: 9.05.2017
C24 C25 = CC0805_18PF_50V_5%_NP0: Non-polarised capacitor; Part Description: SMD Multilayer Chip Ceramic Capacitor; Manufacturer: GENERIC; Manufacturer1 Part Number: 223886115189; Voltage: 50V; TC: C0G/NP0; Tolerance: ±5%; Part Number: CC0805_18PF_50V_5%_NP0; Component Kind: Standard; Component Type: Standard; Pin Count: 2; Value: 18pF; Status: Preferred; Manufacturer Part Number: CC0805_18PF_50V_5%_NP0; Case: 0805; Mounted: Yes; Socket: No; SMD: Yes; Sense: No; Manufacturer1 Example: PHYCOMP; Manufacturer1 ComponentHeight: 1.35mm; HelpURL: \\cern.ch\dfs\Applications\Altium\Datasheets\CC0805_NP0_PHYCOMP.pdf; Author: CERN DEM JLC; CreateDate: 3.12.2007; LatestRevisionDate: 3.12.2007
C26 C27 = CC0805_2.2UF_16V_10%_X7R: Non-polarised capacitor; Part Description: SMD Multilayer Chip Ceramic Capacitor; Manufacturer: GENERIC; Manufacturer1 Part Number: GRM21BF51C225ZA01L; Voltage: 16V; TC: X7R; Tolerance: ±10%; Part Number: CC0805_2.2UF_16V_10%_X7R; Component Kind: Standard; Component Type: Standard; Pin Count: 2; Value: 2.2uF; Status: Preferred; Manufacturer Part Number: CC0805_2.2UF_16V_10%_X7R; Case: 0805; Mounted: Yes; Socket: No; SMD: Yes; Sense: No; Manufacturer1 Example: MURATA; Manufacturer1 ComponentHeight: 1.5mm; HelpURL: \\cern.ch\dfs\Applications\Altium\Datasheets\CC0805_X7R_MURATA_GRM.pdf; Author: CERN DEM JLC; CreateDate: 3.12.2007; LatestRevisionDate: 18.09.2014
D3 = 150060BS75020: WL-SMCW Mono-color Chip LED Waterclear, size 0603, Blue, 3.2V, 140°; Manufacturer: Wurth Elektronik; Case/Size Code: 0603; Chip Technology: InGaN; Dominant Wavelength: 470nm; Luminous Intensity: 150mcd; Peak Wavelength: 465nm; Manufacturer Part Number: 150060BS75020; Category: Signal LEDs; Match Code: WL-SMCW; ComponentLink1Description: Website Link; ComponentLink1URL: https://www.we-online.com/redexpert/article/150060BS75020?ad; ComponentLink2Description: Datasheet Link; ComponentLink2URL: https://www.we-online.com/redexpert/spec/150060BS75020?ad; Mount: Surface Mount; Operating Temperature Max: 85°C; Operating Temperature Min: -40°C; Packaging: Tape and Reel; Length: 1.6mm; Width: 0.8mm; Height: 0.25mm; Emitting Color: Blue; Forward Voltage: 3.2V; Viewing Angle: 140°
D5 = 150060RS75003: WL-SMCW Mono-color Chip LED Waterclear, size 0603, Red, 2V, 140°; Manufacturer: Wurth Elektronik; Case/Size Code: 0603; Chip Technology: AlInGaP; Dominant Wavelength: 625nm; Luminous Intensity: 530mcd; Peak Wavelength: 630nm; Manufacturer Part Number: 150060RS75003; Category: Signal LEDs; Match Code: WL-SMCW; ComponentLink1Description: Website Link; ComponentLink1URL: https://www.we-online.com/redexpert/article/150060RS75003?ad; ComponentLink2Description: Datasheet Link; ComponentLink2URL: https://www.we-online.com/redexpert/spec/150060RS75003?ad; Mount: Surface Mount; Operating Temperature Max: 100°C; Operating Temperature Min: -40°C; Packaging: Tape and Reel; Length: 1.6mm; Width: 0.8mm; Height: 0.7mm; Emitting Color: Red; Forward Voltage: 2V; Viewing Angle: 140°
D6 = 150060VS55040: WL-SMCD Mono-color Chip LED Diffused, SMT, size 0603, Bright Green, 2V, 140°; Manufacturer: Wurth Elektronik; Case/Size Code: 0603; Chip Technology: AlInGaP; Dominant Wavelength: 573nm; Luminous Intensity: 60mcd; Peak Wavelength: 575nm; Manufacturer Part Number: 150060VS55040; Category: Signal LEDs; Match Code: WL-SMCD; ComponentLink1Description: Website Link; ComponentLink1URL: https://www.we-online.com/redexpert/article/150060VS55040?ad; ComponentLink2Description: Datasheet Link; ComponentLink2URL: https://www.we-online.com/redexpert/spec/150060VS55040?ad; Mount: Surface Mount; Operating Temperature Max: 85°C; Operating Temperature Min: -40°C; Packaging: Tape and Reel; Length: 1.6mm; Width: 0.8mm; Height: 0.4mm; Emitting Color: Bright Green; Forward Voltage: 2V; Viewing Angle: 140°
D8 = 150060YS55040: WL-SMCD Mono-color Chip LED Diffused, SMT, size 0603, Yellow, 2V, 140°; Manufacturer: Wurth Elektronik; Case/Size Code: 0603; Chip Technology: AlInGaP; Dominant Wavelength: 589nm; Luminous Intensity: 100mcd; Peak Wavelength: 591nm; Manufacturer Part Number: 150060YS55040; Category: Signal LEDs; Match Code: WL-SMCD; ComponentLink1Description: Website Link; ComponentLink1URL: https://www.we-online.com/redexpert/article/150060YS55040?ad; ComponentLink2Description: Datasheet Link; ComponentLink2URL: https://www.we-online.com/redexpert/spec/150060YS55040?ad; Mount: Surface Mount; Operating Temperature Max: 85°C; Operating Temperature Min: -40°C; Packaging: Tape and Reel; Length: 1.6mm; Width: 0.8mm; Height: 0.4mm; Emitting Color: Yellow; Forward Voltage: 2V; Viewing Angle: 140°
IC1 = STM32F405RGT6: ARM Cortex-M4 32-bit MCU+FPU, 210DMIPS, 1024kB Flash, 192kB+4kB RAM, 51 I/Os, 64-pin LQFP, Industrial Grade –40 to 85°C; Part Description: ARM Cortex-M4 32-bit MCU+FPU, 210DMIPS, 1024KB Flash, 192+4 KB RAM, 51 I/Os, 64-pin LQFP, Industrial Grade –40 to 85°C; Manufacturer: ST MICROELECTRONICS; PressFit: No; Bonding: No; Part Number: STM32F405RGT6; Component Kind: Standard; Component Type: Standard; Device: STM32F405RGT6; PackageDescription: QFP, 0.50mm Pitch, Square; 64 Pin, 10.0mm L X 10.0mm W X 1.60mm H body, IPC Medium Density; Manufacturer Part Number: STM32F405RGT6; Pin Count: 64; Case: QFP64; Mounted: Yes; Socket: No; SMD: Yes; Sense: No; ComponentHeight: 1.6mm; HelpURL: \\cern.ch\dfs\Applications\Altium\Datasheets\STM32F405RGT6.pdf; Author: CERN DEM JLC; CreateDate: 20.06.2017; LatestRevisionDate: 20.06.2017
L3 = IND_10UH_10%_MURATA-PS_8200: Inductor With Core; Part Description: Miniature Surface Mount Power Inductor (8200 Series); Manufacturer: MURATA POWER SOLUTIONS; Manufacturer Part Number: 82103C; Power: 500mA; Resistance: 0.4R; Tolerance: ±10%; Part Number: IND_10UH_10%_MURATA-PS_8200; Component Kind: Standard; Component Type: Standard; Pin Count: 2; Value: 10uH; Mounted: Yes; Socket: No; SMD: Yes; Sense: No; ComponentHeight: 2.3mm; HelpURL: \\cern.ch\dfs\Applications\Altium\Datasheets\IND_MURATA-PS_8200.pdf; Author: CERN DEM JLC; CreateDate: 21.07.2014; LatestRevisionDate: 21.07.2014
P1 = 61300511121: WR-PHD Pin Header, THT, Vertical, pitch 2.54mm, 1 Row, 5P; Manufacturer: Wurth Elektronik; Contact Resistance: 20mOhm; Rated Current: 3A; Working Voltage: 250V; Withstanding Voltage: 500V; Manufacturer Part Number: 61300511121; Category: Board-to-Board Connectors; Match Code: WR-PHD; ComponentLink1Description: Website Link; ComponentLink1URL: https://www.we-online.com/redexpert/article/61300511121?ad; ComponentLink2Description: Datasheet Link; ComponentLink2URL: https://www.we-online.com/redexpert/spec/61300511121?ad; Mount: Through Hole; Operating Temperature Max: 105°C; Operating Temperature Min: -40°C; Packaging: Bag; Gender: Pin Header; Number of Pins: 5; Number of Rows: 1; Orientation: Vertical; Pitch: 2.54mm
P2 = 691322310002: WR-TBL Series 322 Horizontal PCB Header, THT, pitch 3.81mm, 2p; Manufacturer: Wurth Elektronik; Modularity: No; Rated Current: 10A; Working Voltage: 300V; Manufacturer Part Number: 691322310002; Category: Terminal Blocks; Match Code: WR-TBL; ComponentLink1Description: Website Link; ComponentLink1URL: https://www.we-online.com/redexpert/article/691322310002?ad; ComponentLink2Description: Datasheet Link; ComponentLink2URL: https://www.we-online.com/redexpert/spec/691322310002?ad; Mount: Through Hole; Operating Temperature Max: 105°C; Operating Temperature Min: -40°C; Packaging: Box; Application: Pluggable; Number of Pins: 2; Number of Rows: 1; Orientation: Horizontal; Pitch: 3.81mm
P3 = 61300621121: WR-PHD Pin Header, THT, Vertical, pitch 2.54mm, 2 Row, 6P; Manufacturer: Wurth Elektronik; Contact Resistance: 20mOhm; Rated Current: 3A; Working Voltage: 250V; Withstanding Voltage: 500V; Manufacturer Part Number: 61300621121; Category: Board-to-Board Connectors; Match Code: WR-PHD; ComponentLink1Description: Website Link; ComponentLink1URL: https://www.we-online.com/redexpert/article/61300621121?ad; ComponentLink2Description: Datasheet Link; ComponentLink2URL: https://www.we-online.com/redexpert/spec/61300621121?ad; Mount: Through Hole; Operating Temperature Max: 105°C; Operating Temperature Min: -40°C; Packaging: Bag; Gender: Pin Header; Number of Pins: 6; Number of Rows: 2; Orientation: Vertical; Pitch: 2.54mm
P4-P12 = 61300311121: WR-PHD Pin Header, THT, Vertical, pitch 2.54mm, 1 Row, 3P; Manufacturer: Wurth Elektronik; Contact Resistance: 20mOhm; Rated Current: 3A; Working Voltage: 250V; Withstanding Voltage: 500V; Manufacturer Part Number: 61300311121; Category: Board-to-Board Connectors; Match Code: WR-PHD; ComponentLink1Description: Website Link; ComponentLink1URL: https://www.we-online.com/redexpert/article/61300311121?ad; ComponentLink2Description: Datasheet Link; ComponentLink2URL: https://www.we-online.com/redexpert/spec/61300311121?ad; Mount: Through Hole; Operating Temperature Max: 105°C; Operating Temperature Min: -40°C; Packaging: Bag; Gender: Pin Header; Number of Pins: 3; Number of Rows: 1; Orientation: Vertical; Pitch: 2.54mm
PB1 = PB_C&K_KSR223GLFG: Push-Button Switch SPST; Part Description: 32VDC 10mA SPST-NO Surface Mount Subminiature Tact Momentary Pushbutton Switch, Operating Force 2N; Manufacturer: C&K; PressFit: No; Sense Comment: Non-washable; Part Number: PB_C&K_KSR223GLFG; Component Kind: Standard; Component Type: Standard; Pin Count: 2; PackageDescription: Body 7.3x3.8mm, Surface Mount Subminiature Tact Switch, C&K KSR Series; Family: Push Button; Mounted: Yes; Socket: No; SMD: Yes; Sense: Yes; Status: None; Manufacturer Part Number: KSR223GLFG; ComponentHeight: 2.5mm; HelpURL: \\cern.ch\dfs\Applications\Altium\Datasheets\PB_C&K_KSR-Series.pdf; Author: CERN DEM HF; CreateDate: 5.10.2021; LatestRevisionDate: 5.10.2021
R13 R16 R17 = R0805_10K_0.1%_0.1W_10PPM: Resistor - 0.1%; Part Description: Thin Film Chip Resistor; Manufacturer: GENERIC; Manufacturer1 Part Number: RN73C2A10KBTG; Power: 0.1W; TC: ±10ppm; PressFit: No; Part Number: R0805_10K_0.1%_0.1W_10PPM; Component Kind: Standard; Component Type: Standard; Pin Count: 2; Value: 10k; Status: Not Recommended; Manufacturer Part Number: R0805_10K_0.1%_0.1W_10PPM; Case: 0805; Mounted: Yes; Sense: No; Socket: No; SMD: Yes; Manufacturer1 Example: TYCO HOLSWORTHY; Manufacturer1 ComponentHeight: 0.6mm; HelpURL: \\cern.ch\dfs\Applications\Altium\Datasheets\R0805_Tyco_RN73.pdf; Author: CERN DEM JLC; CreateDate: 3.12.2007; LatestRevisionDate: 13.03.2008
R14 R19-R22 = R0805_1K_0.1%_0.125W_25PPM: as R12 on sheet Power; Part Number: R0805_1K_0.1%_0.125W_25PPM; Component Kind: Standard; Component Type: Standard; Pin Count: 2; Value: 1k; Status: Not Recommended; Manufacturer Part Number: R0805_1K_0.1%_0.125W_25PPM; Case: 0805; Mounted: Yes; Sense: No; Socket: No; SMD: Yes; Manufacturer1 Example: PANASONIC; Manufacturer1 ComponentHeight: 0.6mm; HelpURL: \\cern.ch\dfs\Applications\Altium\Datasheets\R0805_PANASONIC_ERA.pdf; Author: CERN DEM JLC; CreateDate: 18.10.2010; LatestRevisionDate: 18.10.2010
R15 = R0805_22K_1%_0.125W_100PPM: Resistor - 1%; Part Description: General Purpose Thick Film Chip Resistor; Manufacturer: GENERIC; Manufacturer1 Part Number: NRC10F2202TRF; Power: 0.125W; TC: ±100ppm/°C; PressFit: No; Part Number: R0805_22K_1%_0.125W_100PPM; Component Kind: Standard; Component Type: Standard; Pin Count: 2; Value: 22k; Status: Preferred; Manufacturer Part Number: R0805_22K_1%_0.125W_100PPM; Case: 0805; Mounted: Yes; Sense: No; Socket: No; SMD: Yes; Manufacturer1 Example: NIC COMPONENT; Manufacturer1 ComponentHeight: 0.6mm; HelpURL: \\cern.ch\dfs\Applications\Altium\Datasheets\R0805_NIC_NRC.pdf; Author: CERN DEM JLC; CreateDate: 3.12.2007; LatestRevisionDate: 13.03.2008
R18 = R0805_100K_1%_0.125W_100PPM: Resistor - 1%; Part Description: General Purpose Thick Film Chip Resistor; Manufacturer: GENERIC; Manufacturer1 Part Number: NRC10F1003TRF; Value: 100k; Power: 0.125W; TC: ±100ppm/°C; PressFit: No; Part Number: R0805_100K_1%_0.125W_100PPM; Component Kind: Standard; Component Type: Standard; Pin Count: 2; Status: Preferred; Manufacturer Part Number: R0805_100K_1%_0.125W_100PPM; Case: 0805; Mounted: Yes; Sense: No; Socket: No; SMD: Yes; Manufacturer1 Example: NIC COMPONENT; Manufacturer1 ComponentHeight: 0.6mm; HelpURL: \\cern.ch\dfs\Applications\Altium\Datasheets\R0805_NIC_NRC.pdf; Author: CERN DEM JLC; CreateDate: 3.12.2007; LatestRevisionDate: 13.03.2008
SCREW1-SCREW4 = BOSSARD_BN5687-3061605_v: Screw; Part Description: M3 L=6mm Hexalobular Socket Pan Head Screw, Fully Threaded, Stainless Steel A2; Manufacturer Part Number: BN5687 Art.3061605; PressFit: No; Part Number: BOSSARD_BN5687-3061605_v; Component Kind: Standard; Component Type: Mechanical; Pin Count: 0; PackageDescription: M3 L=6mm Hexalobular Socket Pan Head Screw, Fully Threaded - Stainless Steel A2; Mounted: Yes; Socket: No; SMD: No; Sense: No; Status: None; Value: M3x6; Manufacturer: BOSSARD; ComponentHeight: 2.4mm; HelpURL: \\cern.ch\dfs\Applications\Altium\Datasheets\BOSSARD_BN5687-3061605.pdf; Author: CERN DEM JLC; CreateDate: 15.01.2013; LatestRevisionDate: 15.01.2013
T1 = 2N2222AUB: NPN Transistor + Exposed Pad; Part Description: 50V 800mA NPN Silicon Switching Transistor; Manufacturer: MICROSEMI; PressFit: No; Bonding: No; Part Number: 2N2222AUB; Component Kind: Standard; Component Type: Standard; Device: 2N2222AUB; PackageDescription: MICROSEMI UB Case, 2.45mm L x 3.08mm W 1.42mm H body; Manufacturer Part Number: 2N2222AUB; Pin Count: 4; Mounted: Yes; Socket: No; SMD: Yes; Sense: No; ComponentHeight: 1.42mm; HelpURL: \\cern.ch\dfs\Applications\Altium\Datasheets\2N2222AUB.pdf; Author: CERN DEM BC; CreateDate: 28.05.2020; LatestRevisionDate: 28.05.2020

## Sheet Modules.SchDoc
size A3; SheetNumber: 3; SheetTotal: 3
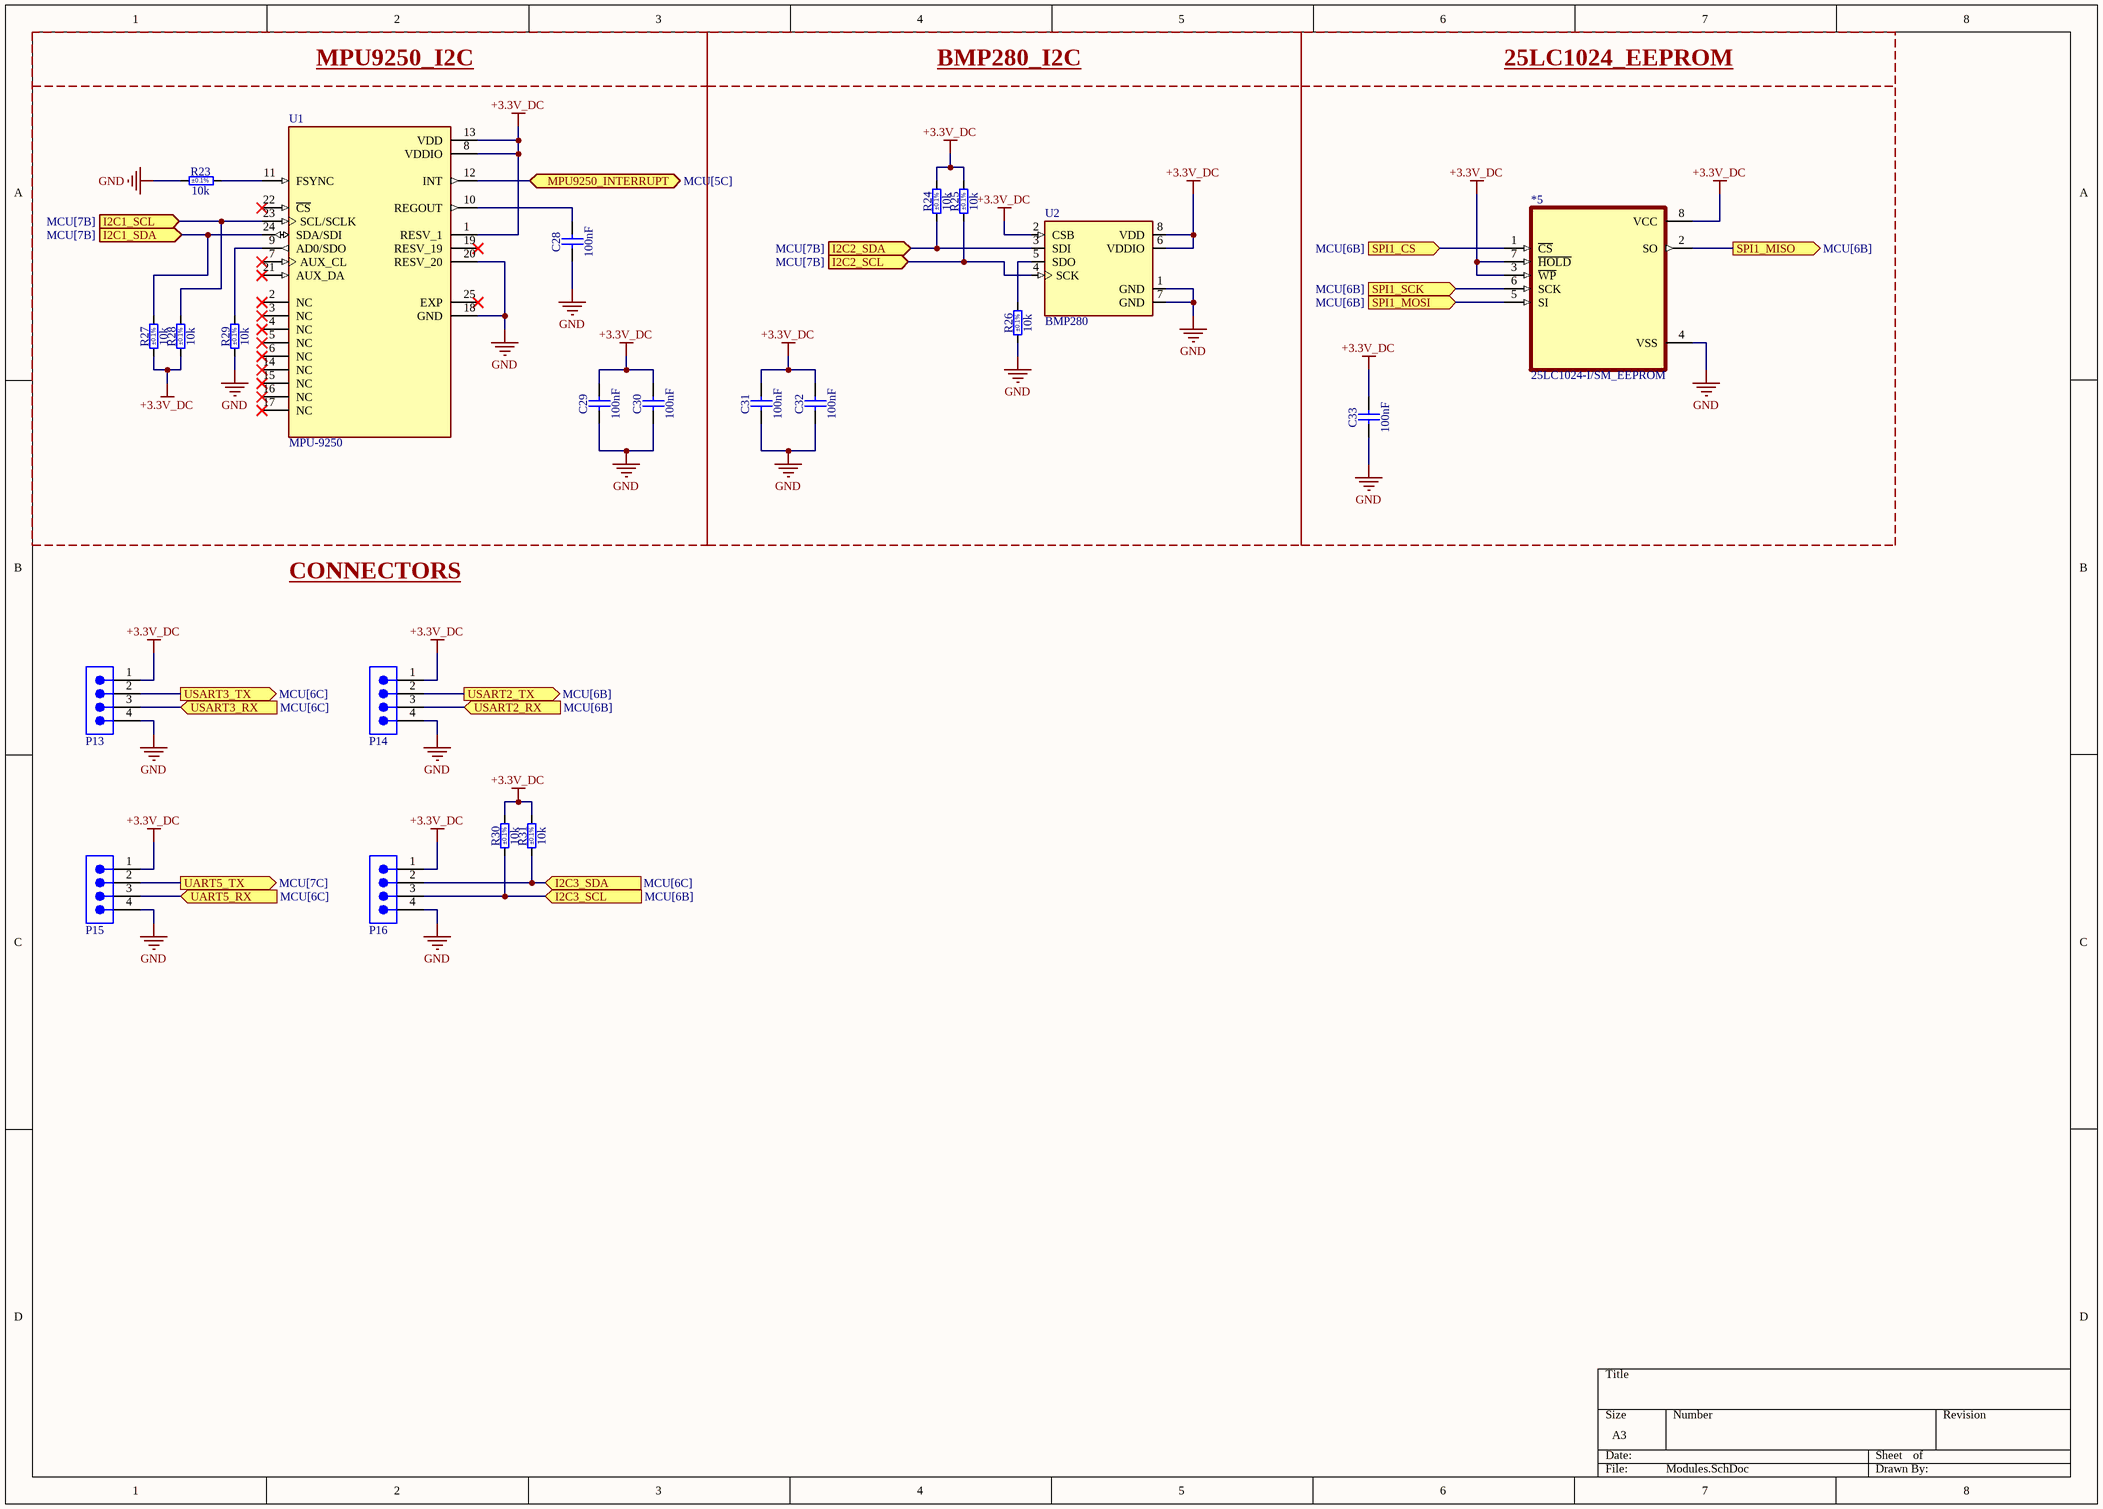
[diagram p2: Modules.SchDoc]

### Parts
*5  25LC1024-I/SM_EEPROM  [25LC1024-I/SM_EEPROM]
C28  100nF  [CAPC2012X135N]
C29  100nF  [CAPC2012X135N]
C30  100nF  [CAPC2012X135N]
C31  100nF  [CAPC2012X135N]
C32  100nF  [CAPC2012X135N]
C33  100nF  [CAPC2012X135N]
P13  691322310004  [691322310004]  (value not drawn)
P14  691322310004  [691322310004]  (value not drawn)
P15  691322310004  [691322310004]  (value not drawn)
P16  691322310004  [691322310004]  (value not drawn)
R23  10k  Tolerance: ±0.1%  [RESC2012X60N]
R24  10k  Tolerance: ±0.1%  [RESC2012X60N]
R25  10k  Tolerance: ±0.1%  [RESC2012X60N]
R26  10k  Tolerance: ±0.1%  [RESC2012X60N]
R27  10k  Tolerance: ±0.1%  [RESC2012X60N]
R28  10k  Tolerance: ±0.1%  [RESC2012X60N]
R29  10k  Tolerance: ±0.1%  [RESC2012X60N]
R30  10k  Tolerance: ±0.1%  [RESC2012X60N]
R31  10k  Tolerance: ±0.1%  [RESC2012X60N]
U1  MPU-9250  [QFN40P300X300X105-25N]
U2  BMP280  [XDCR_BMP280]

### Blocks framed on the sheet
MPU9250_I2C: C28-C30 R23 R27-R29 U1

### Ports
I2C1_SCL (in, see MCU[7B]), I2C1_SDA (in, see MCU[7B]), I2C2_SCL (in, see MCU[7B]), I2C2_SDA (in, see MCU[7B]), I2C3_SCL (in, see MCU[6B]), I2C3_SDA (in, see MCU[6C]), MPU9250_INTERRUPT (bidir, see MCU[5C]), SPI1_CS (in, see MCU[6B]), SPI1_MISO (out, see MCU[6B]), SPI1_MOSI (in, see MCU[6B]), SPI1_SCK (in, see MCU[6B]), UART5_RX (in, see MCU[6C]), UART5_TX (out, see MCU[7C]), USART2_RX (in, see MCU[6B]), USART2_TX (out, see MCU[6B]), USART3_RX (in, see MCU[6C]), USART3_TX (out, see MCU[6C])

### Nets
+3.3V_DC: *5.3(~{WP}) *5.7(~{HOLD}) *5.8(VCC) C29.2 C30.2 C31.2 C32.2 C33.2 P13.1 P14.1 P15.1 P16.1 R24.2 R25.2 R27.1 R28.1 R30.2 R31.2 U1.1(RESV_1) U1.8(VDDIO) U1.13(VDD) U2.2(CSB) U2.6(VDDIO) U2.8(VDD)
GND: *5.4(VSS) C28.1 C29.1 C30.1 C31.1 C32.1 C33.1 P13.4 P14.4 P15.4 P16.4 R23.1 R26.1 R29.1 U1.18(GND) U1.20(RESV_20) U2.1(GND) U2.7(GND)
Net*5_1: *5.1(~{CS}) ; port SPI1_CS
Net*5_2: *5.2(SO) ; port SPI1_MISO
Net*5_5: *5.5(SI) ; port SPI1_MOSI
Net*5_6: *5.6(SCK) ; port SPI1_SCK
NetC28_2: C28.2 U1.10(REGOUT)
NetIC1_8: U1.12(INT) ; port MPU9250_INTERRUPT
NetIC1_16: P14.3 ; port USART2_RX
NetIC1_17: P14.2 ; port USART2_TX
NetIC1_29: R25.1 U2.4(SCK) ; port I2C2_SCL
NetIC1_30: R24.1 U2.3(SDI) ; port I2C2_SDA
NetIC1_40: P16.2 R31.1 ; port I2C3_SDA
NetIC1_41: P16.3 R30.1 ; port I2C3_SCL
NetIC1_51: P13.3 ; port USART3_RX
NetIC1_52: P13.2 ; port USART3_TX
NetIC1_53: P15.3 ; port UART5_RX
NetIC1_54: P15.2 ; port UART5_TX
NetIC1_61: R28.2 U1.23(SCL/SCLK) ; port I2C1_SCL
NetIC1_62: R27.2 U1.24(SDA/SDI) ; port I2C1_SDA
NetR23_2: R23.2 U1.11(FSYNC)
NetR26_2: R26.2 U2.5(SDO)
NetR29_2: R29.2 U1.9(AD0/SDO)

Not connected (* = marked no-connect by the designer): U1 2(NC)* 3(NC)* 4(NC)* 5(NC)* 6(NC)* 7(AUX_CL)* 14(NC)* 15(NC)* 16(NC)* 17(NC)* 19(RESV_19)* 21(AUX_DA)* 22(~{CS})* 25(EXP)*

### Notes on the sheet
- BMP280_I2C
- 25LC1024_EEPROM
- CONNECTORS

### Library data of the parts
C28-C33 = CC0805_100NF_50V_10%_X7R: as C1 on sheet Power; Part Number: CC0805_100NF_50V_10%_X7R; Component Kind: Standard; Component Type: Standard; Pin Count: 2; Value: 100nF; Status: None; Manufacturer Part Number: CC0805_100NF_50V_10%_X7R; Case: 0805; Mounted: Yes; Socket: No; SMD: Yes; Sense: No; Manufacturer1 Example: TDK; Manufacturer1 ComponentHeight: 1mm; HelpURL: \\cern.ch\dfs\Applications\Altium\Datasheets\CC0805_X7R_TDK_C.pdf; Author: CERN DEM JLC; CreateDate: 3.12.2007; LatestRevisionDate: 22.04.2015
P13-P16 = 691322310004: WR-TBL Series 322 Horizontal PCB Header, THT, pitch 3.81mm, 4p; Manufacturer: Wurth Elektronik; Modularity: No; Rated Current: 10A; Working Voltage: 300V; Manufacturer Part Number: 691322310004; Category: Terminal Blocks; Match Code: WR-TBL; ComponentLink1Description: Website Link; ComponentLink1URL: https://www.we-online.com/redexpert/article/691322310004?ad; ComponentLink2Description: Datasheet Link; ComponentLink2URL: https://www.we-online.com/redexpert/spec/691322310004?ad; Mount: Through Hole; Operating Temperature Max: 105°C; Operating Temperature Min: -40°C; Packaging: Box; Application: Pluggable; Number of Pins: 4; Number of Rows: 1; Orientation: Horizontal; Pitch: 3.81mm
R23-R31 = R0805_10K_0.1%_0.1W_10PPM: as R13 on sheet MCU; Part Number: R0805_10K_0.1%_0.1W_10PPM; Component Kind: Standard; Component Type: Standard; Pin Count: 2; Value: 10k; Status: Not Recommended; Manufacturer Part Number: R0805_10K_0.1%_0.1W_10PPM; Case: 0805; Mounted: Yes; Sense: No; Socket: No; SMD: Yes; Manufacturer1 Example: TYCO HOLSWORTHY; Manufacturer1 ComponentHeight: 0.6mm; HelpURL: \\cern.ch\dfs\Applications\Altium\Datasheets\R0805_Tyco_RN73.pdf; Author: CERN DEM JLC; CreateDate: 3.12.2007; LatestRevisionDate: 13.03.2008
U1 = MPU-9250: MPU-9250 series Accelerometer, Gyroscope, Humidity, Magnetometer, Pressure, Temperature Sensor Evaluation Board; MF: TDK InvenSense; SnapEDA_Link: https://www.snapeda.com/parts/MPU-9250/TDK+InvenSense/view-part/?ref=snap; Package: TFQFN-24 TDK InvenSense; Value: *; MP: MPU-9250; Check_prices: https://www.snapeda.com/parts/MPU-9250/TDK+InvenSense/view-part/?ref=eda
U2 = BMP280: BMP280 Absolute Barometric Pressure Sensor for Battery Powered Devices 2 x 2.5mm; Package: None; Availability: Unavailable; MP: BMP280; Value: *; Price: None

## Nets that join several sheets
+3.3V_DC: Power (6 pins), MCU (17 pins), Modules (24 pins)
+5V_DC: Power (11 pins), MCU (10 pins)
GND: Power (28 pins), MCU (36 pins), Modules (18 pins)
Net*5_1: MCU (IC1.20), Modules (*5.1)
Net*5_2: MCU (IC1.22), Modules (*5.2)
Net*5_5: MCU (IC1.23), Modules (*5.5)
Net*5_6: MCU (IC1.21), Modules (*5.6)
NetIC1_8: MCU (IC1.8), Modules (U1.12)
NetIC1_16: MCU (IC1.16), Modules (P14.3)
NetIC1_17: MCU (IC1.17), Modules (P14.2)
NetIC1_29: MCU (IC1.29), Modules (R25.1 U2.4)
NetIC1_30: MCU (IC1.30), Modules (R24.1 U2.3)
NetIC1_40: MCU (IC1.40), Modules (P16.2 R31.1)
NetIC1_41: MCU (IC1.41), Modules (P16.3 R30.1)
NetIC1_44: Power (R10.2), MCU (IC1.44)
NetIC1_45: Power (R11.2), MCU (IC1.45)
NetIC1_51: MCU (IC1.51), Modules (P13.3)
NetIC1_52: MCU (IC1.52), Modules (P13.2)
NetIC1_53: MCU (IC1.53), Modules (P15.3)
NetIC1_54: MCU (IC1.54), Modules (P15.2)
NetIC1_61: MCU (IC1.61), Modules (R28.2 U1.23)
NetIC1_62: MCU (IC1.62), Modules (R27.2 U1.24)